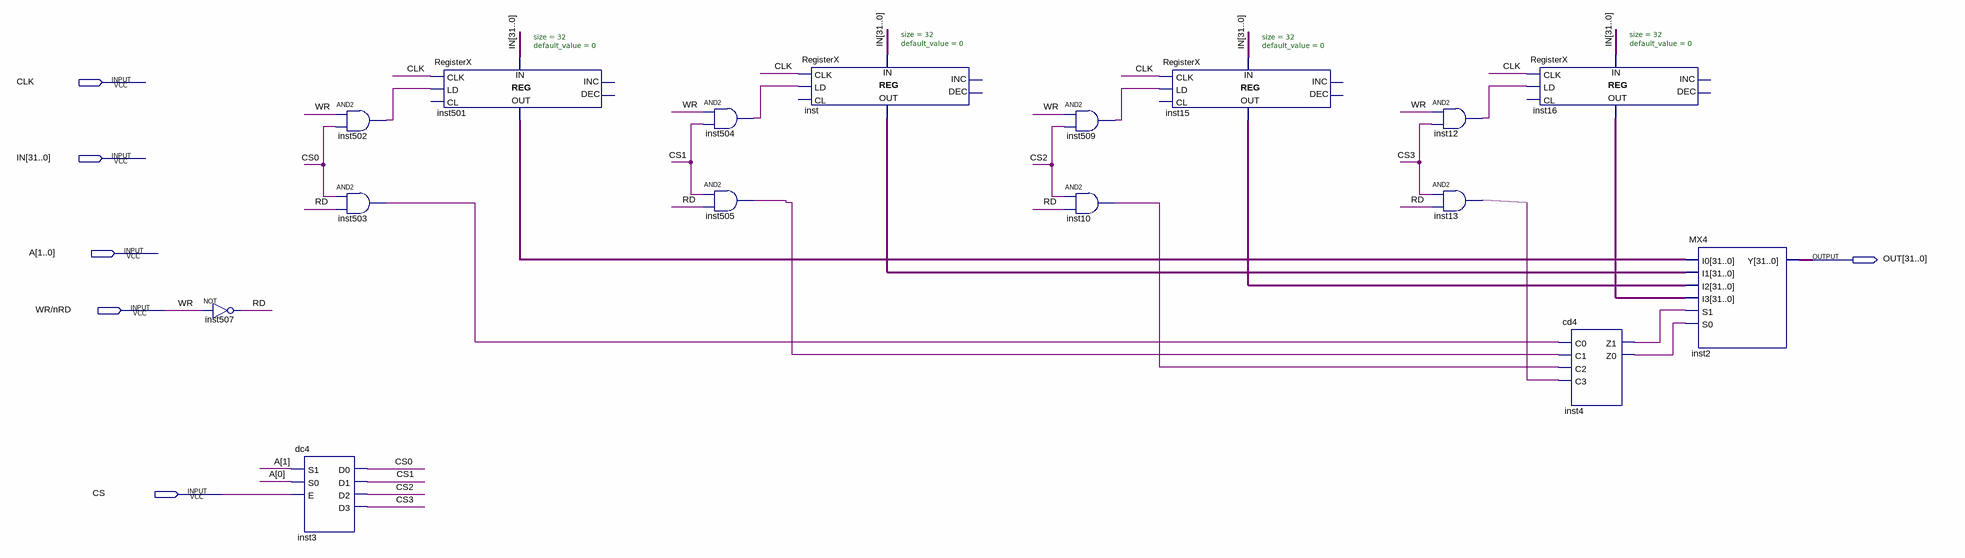
[diagram p0: schematic sheet]
// Quartus schematic RegFile4.bdf as structural Verilog: 16 symbols, 6 pins
module RegFile4 (
  input  CLK,
  input  [31:0] IN,
  input  [1:0] A,
  input  \WR/nRD ,
  input  CS,
  output [31:0] OUT
);

  wire CS0, CS1, CS2, CS3, inst4_z0, inst4_z1, inst10_out, inst12_out, inst13_out, inst502_out, inst503_out,
       inst504_out, inst505_out, inst509_out, RD;
  wire [31:0] inst15_data_out, inst16_data_out, inst501_data_out, inst_data_out;

  not inst507 (RD, \WR/nRD );
  dc4 inst3 (.S1(A[1]), .S0(A[0]), .E(CS), .D0(CS0), .D1(CS1), .D2(CS2), .D3(CS3));
  and inst502 (inst502_out, \WR/nRD , CS0);
  and inst503 (inst503_out, CS0, RD);
  RegisterX #(.size(32), .default_value(0)) inst501 (
    .CLK(CLK), .LD(inst502_out), .DATA_IN(IN), .DATA_OUT(inst501_data_out));  // open: CL, INC, DEC
  and inst504 (inst504_out, \WR/nRD , CS1);
  and inst505 (inst505_out, CS1, RD);
  RegisterX #(.size(32), .default_value(0)) inst (
    .CLK(CLK), .LD(inst504_out), .DATA_IN(IN), .DATA_OUT(inst_data_out));  // open: CL, INC, DEC
  and inst509 (inst509_out, \WR/nRD , CS2);
  and inst10 (inst10_out, CS2, RD);
  RegisterX #(.size(32), .default_value(0)) inst15 (
    .CLK(CLK), .LD(inst509_out), .DATA_IN(IN), .DATA_OUT(inst15_data_out));  // open: CL, INC, DEC
  and inst12 (inst12_out, \WR/nRD , CS3);
  and inst13 (inst13_out, CS3, RD);
  RegisterX #(.size(32), .default_value(0)) inst16 (
    .CLK(CLK), .LD(inst12_out), .DATA_IN(IN), .DATA_OUT(inst16_data_out));  // open: CL, INC, DEC
  cd4 inst4 (.C0(inst503_out), .C1(inst505_out), .C2(inst10_out), .C3(inst13_out), .Z1(inst4_z1), .Z0(inst4_z0));
  MX4 inst2 (
    .I0(inst501_data_out), .I1(inst_data_out), .I2(inst15_data_out), .I3(inst16_data_out), .S1(inst4_z1),
    .S0(inst4_z0), .Y(OUT));

  // Other names for the same wires on the sheet: WR = \WR/nRD 
endmodule
